# EAGLE design 2_dsub_to_pins_quick (EAGLE 7.2.0)
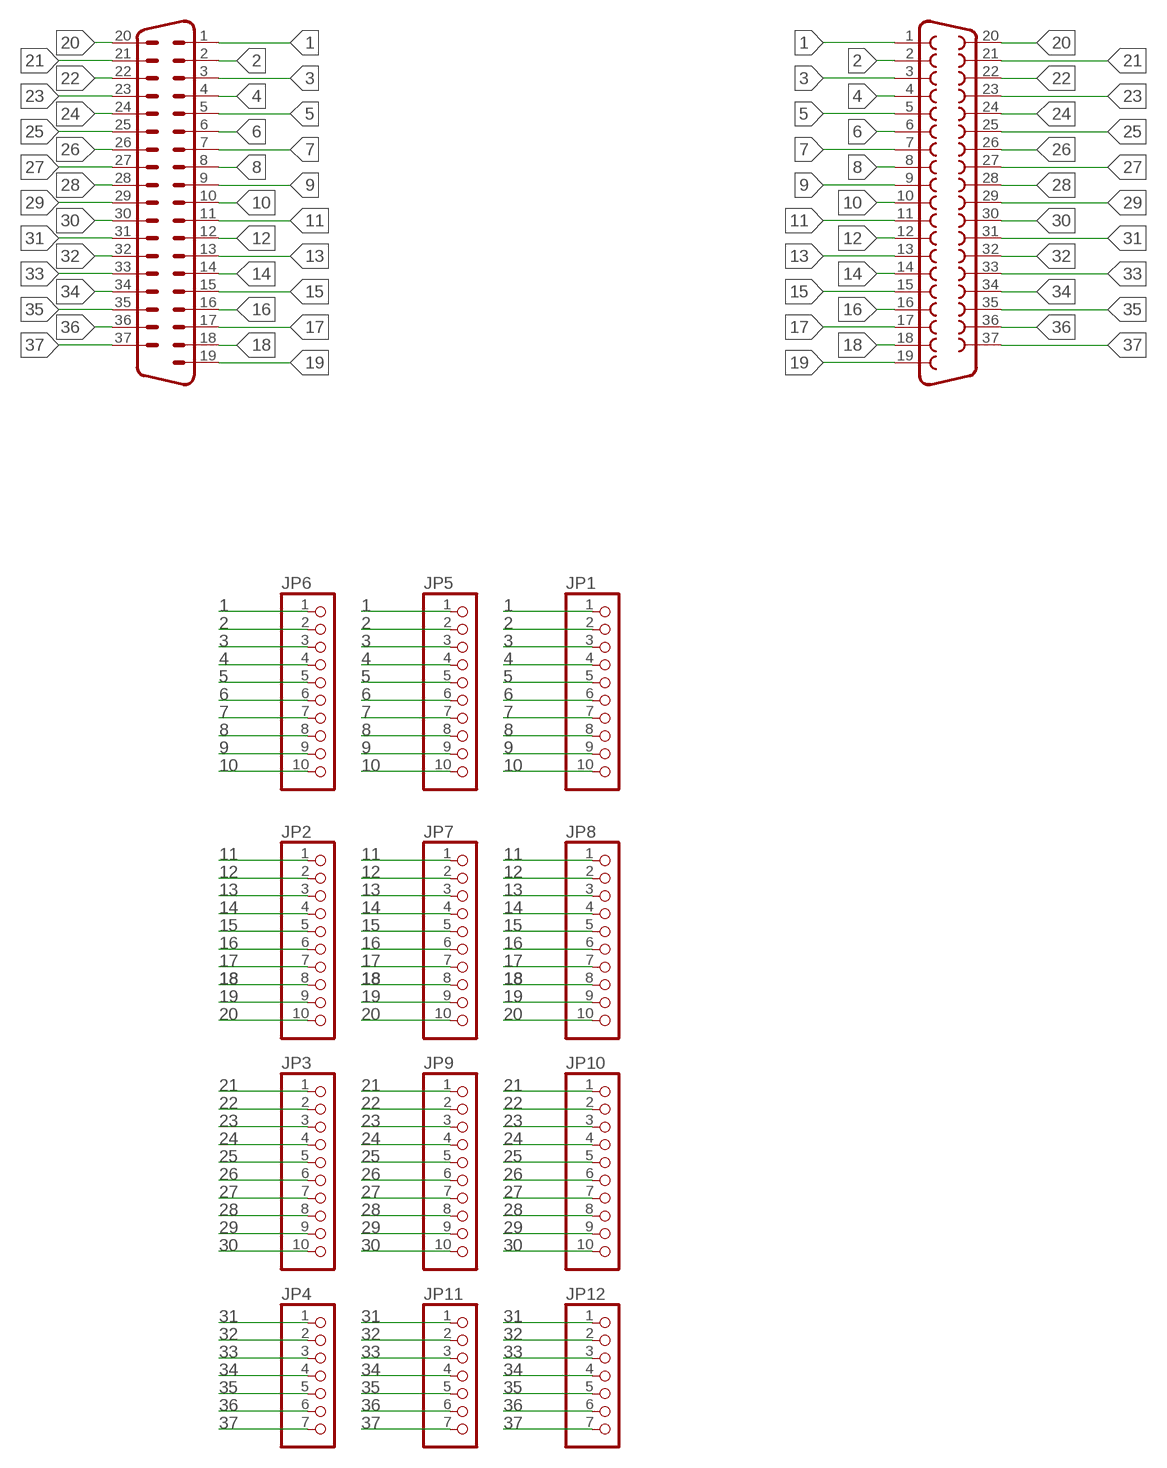
[diagram p0: schematic, sheet 1]

## Parts
JP1  PINHD-1X10  [1X10]
JP2  PINHD-1X10  [1X10]
JP3  PINHD-1X10  [1X10]
JP4  PINHD-1X7  [1X07]
JP5  PINHD-1X10  [1X10]
JP6  PINHD-1X10  [1X10]
JP7  PINHD-1X10  [1X10]
JP8  PINHD-1X10  [1X10]
JP9  PINHD-1X10  [1X10]
JP10  PINHD-1X10  [1X10]
JP11  PINHD-1X7  [1X07]
JP12  PINHD-1X7  [1X07]
X33  M37HP  [M37HP]
X34  F37HP  [F37HP]

## Nets
1: JP1.1 JP5.1 JP6.1 X33.1 X34.1
2: JP1.2 JP5.2 JP6.2 X33.2 X34.2
3: JP1.3 JP5.3 JP6.3 X33.3 X34.3
4: JP1.4 JP5.4 JP6.4 X33.4 X34.4
5: JP1.5 JP5.5 JP6.5 X33.5 X34.5
6: JP1.6 JP5.6 JP6.6 X33.6 X34.6
7: JP1.7 JP5.7 JP6.7 X33.7 X34.7
8: JP1.8 JP5.8 JP6.8 X33.8 X34.8
9: JP1.9 JP5.9 JP6.9 X33.9 X34.9
10: JP1.10 JP5.10 JP6.10 X33.10 X34.10
11: JP2.1 JP7.1 JP8.1 X33.11 X34.11
12: JP2.2 JP7.2 JP8.2 X33.12 X34.12
13: JP2.3 JP7.3 JP8.3 X33.13 X34.13
14: JP2.4 JP7.4 JP8.4 X33.14 X34.14
15: JP2.5 JP7.5 JP8.5 X33.15 X34.15
16: JP2.6 JP7.6 JP8.6 X33.16 X34.16
17: JP2.7 JP7.7 JP8.7 X33.17 X34.17
18: JP2.8 JP7.8 JP8.8 X33.18 X34.18
19: JP2.9 JP7.9 JP8.9 X33.19 X34.19
20: JP2.10 JP7.10 JP8.10 X33.20 X34.20
21: JP3.1 JP9.1 JP10.1 X33.21 X34.21
22: JP3.2 JP9.2 JP10.2 X33.22 X34.22
23: JP3.3 JP9.3 JP10.3 X33.23 X34.23
24: JP3.4 JP9.4 JP10.4 X33.24 X34.24
25: JP3.5 JP9.5 JP10.5 X33.25 X34.25
26: JP3.6 JP9.6 JP10.6 X33.26 X34.26
27: JP3.7 JP9.7 JP10.7 X33.27 X34.27
28: JP3.8 JP9.8 JP10.8 X33.28 X34.28
29: JP3.9 JP9.9 JP10.9 X33.29 X34.29
30: JP3.10 JP9.10 JP10.10 X33.30 X34.30
31: JP4.1 JP11.1 JP12.1 X33.31 X34.31
32: JP4.2 JP11.2 JP12.2 X33.32 X34.32
33: JP4.3 JP11.3 JP12.3 X33.33 X34.33
34: JP4.4 JP11.4 JP12.4 X33.34 X34.34
35: JP4.5 JP11.5 JP12.5 X33.35 X34.35
36: JP4.6 JP11.6 JP12.6 X33.36 X34.36
37: JP4.7 JP11.7 JP12.7 X33.37 X34.37

## Library data of the parts
JP1-JP3 JP5-JP10 = pinhead:PINHD-1X10: PIN HEADER
JP4 JP11 JP12 = pinhead:PINHD-1X7: PIN HEADER
X33 = con-subd:M37: SUB-D; OC_FARNELL: unknown; OC_NEWARK: unknown
X34 = con-subd:F37: SUB-D; OC_FARNELL: unknown; OC_NEWARK: unknown

## Board
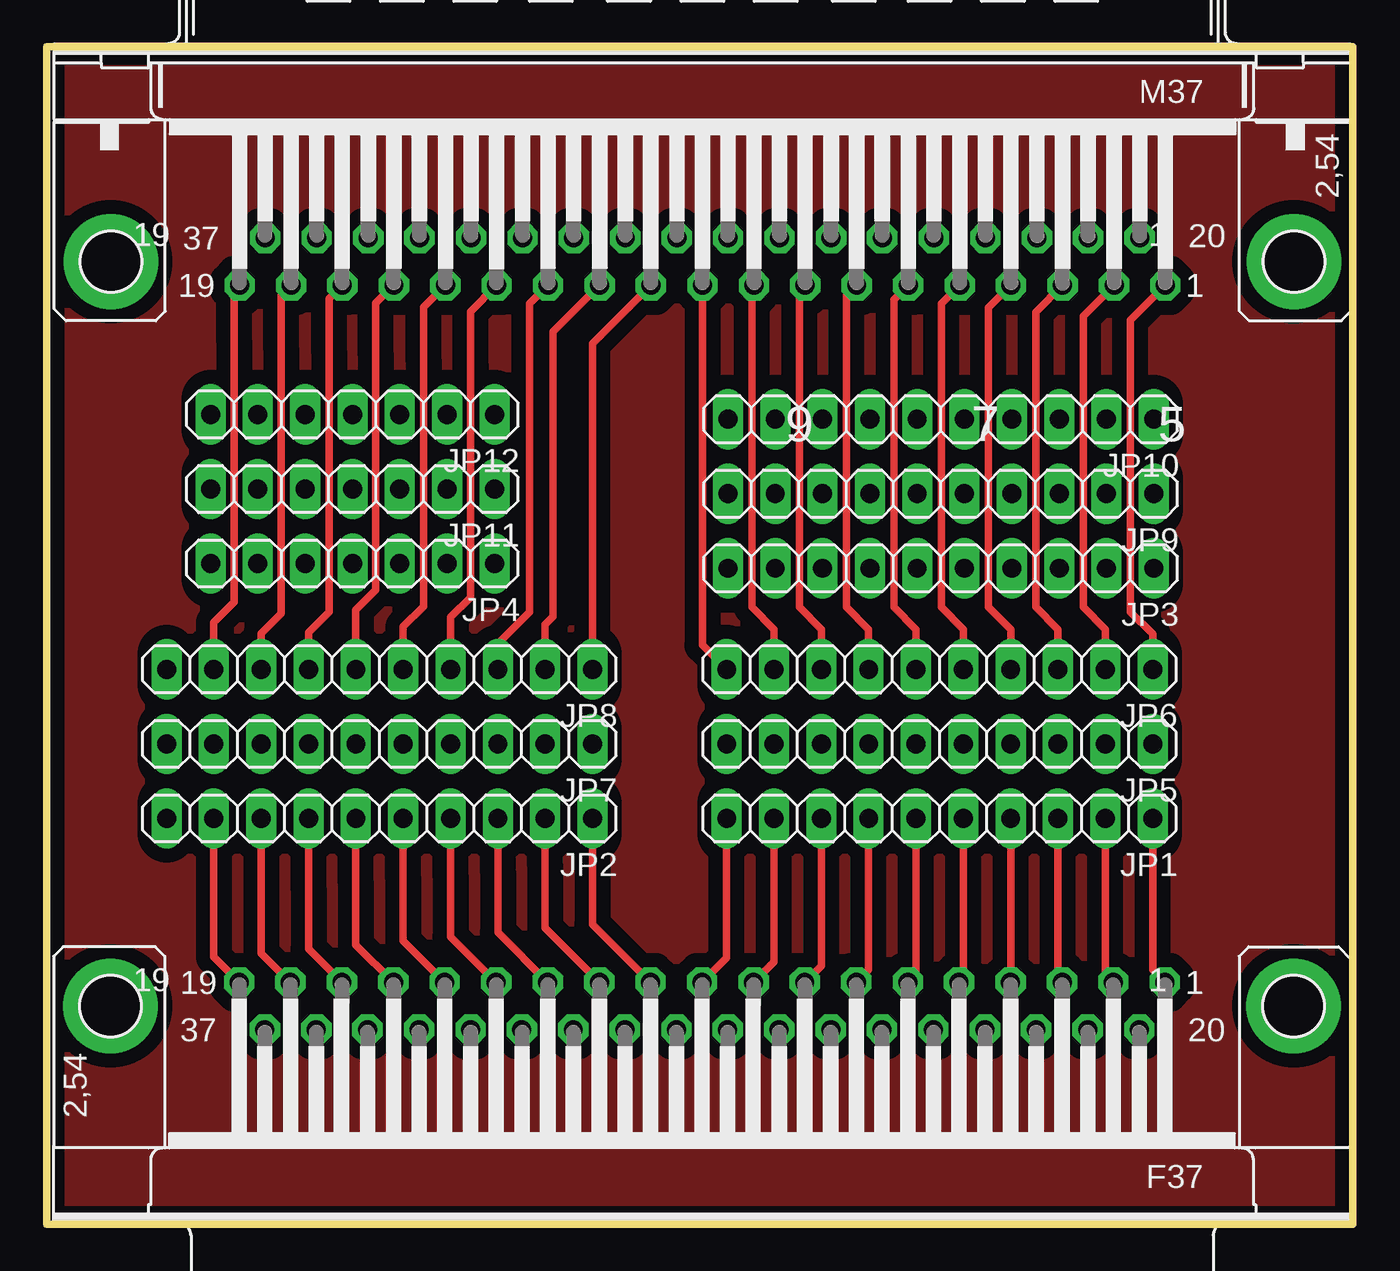
[diagram p1: board, top side]
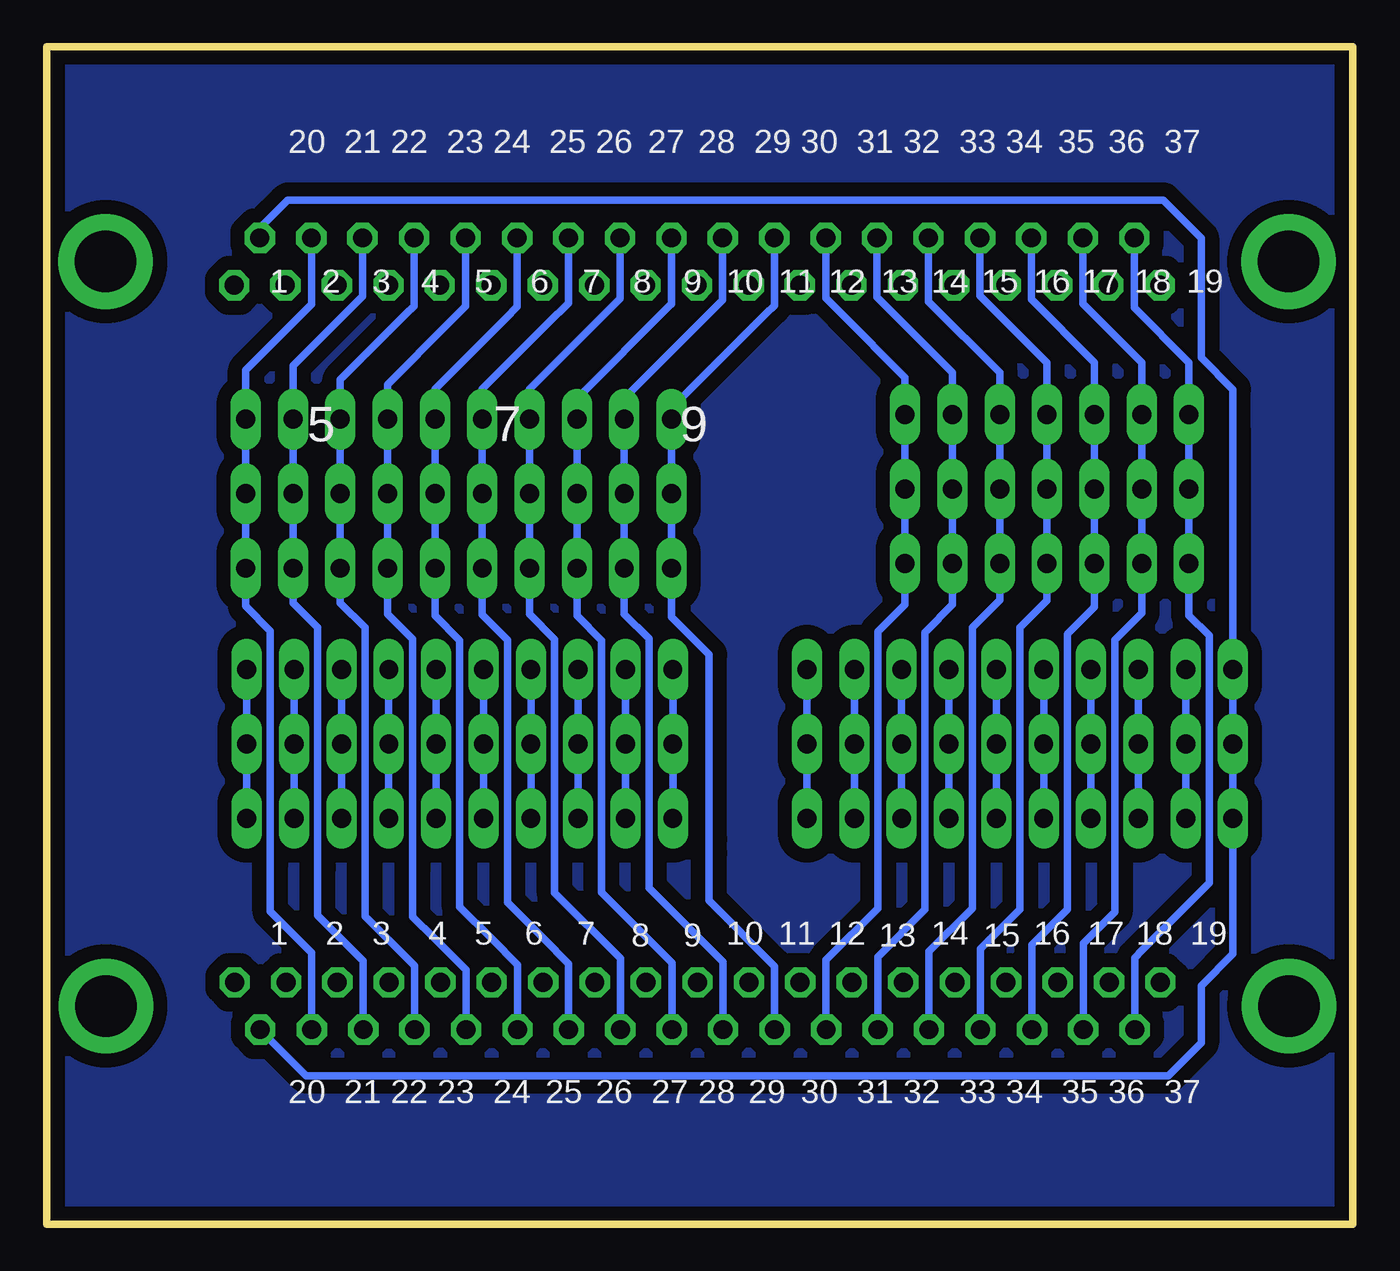
[diagram p2: board, bottom side, seen from below]

Size 70.11 x 63.21 mm. Coordinates in mm from the lower left corner, seen from the top.
Outline: 3,63.21 70.11,63.21 70.11,0 0,0 0,63.21 3.5,63.21
Copper layers (1*16): Top 0.035mm / dielectric 1.5mm / Bottom 0.035mm
Design rules "SparkFun-2-layer": minimum track width 7mil, minimum drill 15mil, track to track 8mil, track to pad 8mil, pad to pad 8mil, via to via 8mil, smd to smd 8mil, copper to edge 8mil, drill to drill 8mil, minimum pad ring 12mil, minimum via ring 10mil, stop-mask expansion 4mil, vias tented up to drill 20mil, thermal gap 10mil

### Footprints (pad centres in the part's own frame; a part is rotated, then mirrored left to right if it is on the bottom)
1X10 = drill 1.016 long: 1 -11.43,0; 2 -8.89,0; 3 -6.35,0; 4 -3.81,0; 5 -1.27,0; 6 1.27,0; 7 3.81,0; 8 6.35,0; 9 8.89,0; 10 11.43,0
1X07 = drill 1.016 long: 1 -7.62,0; 2 -5.08,0; 3 -2.54,0; 4 0,0; 5 2.54,0; 6 5.08,0; 7 7.62,0
M37HP = drill 1.016 octagon: 1 -24.841,1.27; 2 -22.098,1.27; 3 -19.329,1.27; 4 -16.561,1.27; 5 -13.818,1.27; 6 -11.049,1.27; 7 -8.28,1.27; 8 -5.512,1.27; 9 -2.769,1.27; 10 0,1.27; 11 2.769,1.27; 12 5.512,1.27; 13 8.28,1.27; 14 11.049,1.27; 15 13.792,1.27; 16 16.561,1.27; 17 19.329,1.27; 18 22.073,1.27; 19 24.841,1.27; 20 -23.47,-1.27; 21 -20.701,-1.27; 22 -17.958,-1.27; 23 -15.189,-1.27; 24 -12.421,-1.27; 25 -9.652,-1.27; 26 -6.909,-1.27; 27 -4.14,-1.27; 28 -1.372,-1.27; 29 1.372,-1.27; 30 4.14,-1.27; 31 6.909,-1.27; 32 9.652,-1.27; 33 12.421,-1.27; 34 15.189,-1.27; 35 17.932,-1.27; 36 20.701,-1.27; 37 23.47,-1.27 | drill 3.302 pad 5.08: G1 -31.75,0; G2 31.75,0
F37HP = drill 1.016 octagon: 1 -24.841,-1.27; 2 -22.073,-1.27; 3 -19.329,-1.27; 4 -16.561,-1.27; 5 -13.792,-1.27; 6 -11.049,-1.27; 7 -8.28,-1.27; 8 -5.512,-1.27; 9 -2.769,-1.27; 10 0,-1.27; 11 2.769,-1.27; 12 5.512,-1.27; 13 8.28,-1.27; 14 11.049,-1.27; 15 13.818,-1.27; 16 16.561,-1.27; 17 19.329,-1.27; 18 22.098,-1.27; 19 24.841,-1.27; 20 -23.47,1.27; 21 -20.701,1.27; 22 -17.932,1.27; 23 -15.189,1.27; 24 -12.421,1.27; 25 -9.652,1.27; 26 -6.909,1.27; 27 -4.14,1.27; 28 -1.372,1.27; 29 1.372,1.27; 30 4.14,1.27; 31 6.909,1.27; 32 9.677,1.27; 33 12.421,1.27; 34 15.189,1.27; 35 17.958,1.27; 36 20.701,1.27; 37 23.47,1.27 | drill 3.302 pad 5.08: G1 -31.75,0; G2 31.75,0

### Placement (x,y rotation side)
JP1  47.93,21.79 180 top
JP2  17.87,21.79 180 top
JP3  48,35.21 180 top
JP4  16.42,35.47 180 top
JP5  47.93,25.79 180 top
JP6  47.93,29.79 180 top
JP7  17.87,25.79 180 top
JP8  17.87,29.79 180 top
JP9  48,39.21 180 top
JP10  48,43.21 180 top
JP11  16.42,39.47 180 top
JP12  16.42,43.47 180 top
X33  35.2,51.67 180 top
X34  35.18,11.72 180 top

### Tracks (layer width: path | path; a pad name or v marks a point on that pad's centre or on a via)
1
  Top 0.4: JP6.1 59.36,31.68 58.18,32.87 58.18,48.54 X33.1 | X34.1 59.36,13.65 JP1.1
  Bottom 0.4: JP6.1 JP5.1 JP1.1
2
  Top 0.4: JP6.2 56.82,31.94 55.64,33.12 55.64,48.75 X33.2 | X34.2 56.82,13.42 JP1.2
  Bottom 0.4: JP6.2 JP5.2 JP1.2
3
  Top 0.4: JP6.3 54.28,31.94 53.1,33.12 53.1,48.97 X33.3 | X34.3 54.28,13.21 JP1.3
  Bottom 0.4: JP6.3 JP5.3 JP1.3
4
  Top 0.4: JP6.4 51.74,31.94 50.56,33.12 50.56,49.2 X33.4 | X34.4 JP1.4
  Bottom 0.4: JP6.4 JP5.4 JP1.4
5
  Top 0.4: JP6.5 49.2,31.94 48.02,33.12 48.02,49.41 X33.5 | X34.5 49.2,13.22 JP1.5
  Bottom 0.4: JP6.5 JP5.5 JP1.5
6
  Top 0.4: JP6.6 46.66,31.94 45.48,33.12 45.48,49.63 X33.6 | X34.6 46.66,13.43 JP1.6
  Bottom 0.4: JP6.6 JP5.6 JP1.6
7
  Top 0.4: JP6.7 44.12,31.94 42.94,33.12 42.94,49.86 X33.7 | X34.7 44.12,13.65 JP1.7
  Bottom 0.4: JP6.7 JP5.7 JP1.7
8
  Top 0.4: JP6.8 41.58,31.94 40.4,33.12 40.4,50.09 X33.8 | X34.8 41.58,13.88 JP1.8
  Bottom 0.4: JP6.8 JP5.8 JP1.8
9
  Top 0.4: JP6.9 39.04,31.94 37.86,33.12 37.86,50.29 X33.9 | X34.9 39.04,14.09 JP1.9
  Bottom 0.4: JP6.9 JP5.9 JP1.9
10
  Top 0.4: X33.10 35.2,31.09 JP6.10 | X34.10 36.5,14.31 JP1.10
  Bottom 0.4: JP6.10 JP5.10 JP1.10
11
  Top 0.4: JP8.1 29.3,44.48 29.3,47.27 X33.11 | JP2.1 29.3,19.4 29.3,16.1 X34.11
  Bottom 0.4: JP8.1 JP7.1 JP2.1
12
  Top 0.4: JP8.2 26.76,32.18 27.19,32.61 27.19,45.11 27.19,47.91 X33.12 | JP2.2 26.76,19.2 26.76,15.9 X34.12
  Bottom 0.4: JP8.2 JP7.2 JP2.2
13
  Top 0.4: JP8.3 24.22,31.17 25.92,32.87 25.92,46.33 25.92,49.41 X33.13 26.92,50.12 | JP2.3 24.22,18.97 24.22,15.67 X34.13
  Bottom 0.4: JP8.3 JP7.3 JP2.3
14
  Top 0.4: JP8.4 21.68,32.59 22.75,33.66 22.75,46.2 22.75,49 X33.14 | JP2.4 21.68,18.74 21.68,15.44 X34.14
  Bottom 0.4: JP8.4 JP7.4 JP2.4
15
  Top 0.4: JP8.5 19.14,32.08 20.23,33.17 20.23,46.43 20.23,49.23 X33.15 | JP2.5 19.14,18.51 19.14,15.21 X34.15
  Bottom 0.4: JP8.5 JP7.5 JP2.5
16
  Top 0.4: JP8.6 16.6,32.97 17.67,34.04 17.67,46.64 17.67,49.43 X33.16 | JP2.6 16.6,18.31 16.6,15.01 X34.16
  Bottom 0.4: JP8.6 JP7.6 JP2.6
17
  Top 0.4: JP8.7 14.06,31.78 15.15,32.87 15.15,46.89 15.15,49.69 X33.17 | JP2.7 14.06,18.08 14.06,14.78 X34.17
  Bottom 0.4: JP8.7 JP7.7 JP2.7
18
  Top 0.4: JP8.8 11.52,31.73 12.59,32.79 12.59,47.07 12.59,49.86 X33.18 | JP2.8 11.52,14.55 X34.18
  Bottom 0.4: JP8.8 JP7.8 JP2.8
19
  Top 0.4: JP8.9 8.98,32.31 10.07,33.4 10.07,47.32 10.07,50.12 X33.19 | JP2.9 8.98,14.35 X34.19
  Bottom 0.4: JP8.9 JP7.9 JP2.9
20
  Bottom 0.4: X34.20 56.18,7.98 9.92,7.98 8.14,9.75 8.14,12.8 6.44,14.5 JP2.10 6.44,22.45 JP7.10 JP8.10 6.44,42.6 6.44,44.81 8.14,46.51 8.14,49.89 8.14,52.93 10.17,54.97 57.16,54.97 58.67,53.46 X33.20
21
  Bottom 0.4: X33.21 55.89,49.38 59.43,45.84 JP10.1 JP9.1 JP3.1 59.43,34.39 | 59.43,34.39 59.43,33.61 | X34.21 55.88,13.55 | 55.88,13.55 55.89,13.56 | 55.88,13.55 55.88,14.57 58.1,16.79 58.1,19.33 58.1,31.85 59.43,33.18 59.43,34.39
22
  Bottom 0.4: X33.22 53.16,49.83 54.88,48.11 56.89,46.1 JP10.2 JP9.2 JP3.2 56.89,33.35 55.64,32.11 55.56,32.03 55.56,19.13 55.56,16.59 53.11,14.14 X34.22
23
  Bottom 0.4: X33.23 50.39,49.3 50.81,48.87 54.35,45.34 JP10.3 JP9.3 JP3.3 54.35,33.35 53.02,32.03 53.02,19.08 53.02,16.54 51.83,15.34 50.37,13.88 X34.23
24
  Bottom 0.4: X33.24 47.62,49.27 48.53,48.36 51.81,45.08 JP10.4 JP9.4 JP3.4 51.81,32.77 50.46,31.42 50.46,19.05 50.46,16.51 49.29,15.34 47.6,13.65 X34.24
25
  Bottom 0.4: X33.25 44.85,49.24 45.48,48.62 49.27,44.83 JP10.5 JP9.5 JP3.5 49.27,32.67 47.94,31.34 47.94,19.91 | X34.25 44.83,13.93 46.24,15.34 47.94,17.04 47.94,19.91 | 47.94,19.58 47.94,19.91
26
  Bottom 0.4: X33.26 42.11,49.45 43.19,48.36 46.73,44.83 JP10.6 JP9.6 JP3.6 46.73,32.72 45.38,31.37 45.38,20.42 | X34.26 42.09,13.98 43.45,15.34 45.38,17.27 45.38,20.42 | 45.38,19.81 45.38,20.42
27
  Bottom 0.4: X33.27 39.34,49.68 39.89,49.12 44.19,44.83 JP10.7 JP9.7 JP3.7 44.19,32.74 42.84,31.39 42.84,21.18 | X34.27 39.32,14.26 42.84,17.78 42.84,21.18 | 42.84,20.32 42.84,21.18
28
  Bottom 0.4: X33.28 36.57,49.4 36.59,49.38 41.65,44.32 JP10.8 JP9.8 JP3.8 41.65,32.67 40.32,31.34 40.32,20.93 | X34.28 36.55,14.03 40.32,17.81 40.32,20.93 | 40.32,20.35 40.32,20.93
29
  Bottom 0.4: X33.29 33.83,49.6 34.05,49.38 39.11,44.32 JP10.9 JP9.9 JP3.9 39.11,32.77 37.78,31.45 37.78,20.6 37.78,20.09 37.78,18.06 34.3,14.58 33.81,14.08 X34.29
30
  Bottom 0.4: X33.30 31.06,49.32 31.51,48.87 36.57,43.81 JP10.10 JP9.10 JP3.10 36.57,32.59 34.94,30.96 | 34.94,30.96 34.56,30.58 | X34.30 31.04,13.86 34.56,17.37 34.56,20.68 | 34.56,19.91 34.56,20.68 | 34.56,20.68 34.56,30.58 | 34.56,30.58 34.94,30.96
31
  Bottom 0.4: X33.31 28.29,49.72 27.45,48.87 | 27.45,48.87 27.19,48.62 | X34.31 28.27,12.04 28.27,14.19 25.49,16.97 25.49,20.27 25.49,31.83 24.04,33.28 JP4.1 JP11.1 JP12.1 24.04,45.46 27.45,48.87
32
  Bottom 0.4: X33.32 25.55,49.77 21.5,45.71 JP12.2 JP11.2 JP4.2 21.5,33.26 22.95,31.8 22.98,31.78 22.98,20.19 22.98,16.89 25.5,14.36 25.5,13.06 X34.32
33
  Bottom 0.4: X33.33 22.78,49.54 18.96,45.71 JP12.3 JP11.3 JP4.3 18.96,33.51 20.44,32.03 20.44,20.27 20.44,16.97 22.76,14.64 X34.33
34
  Bottom 0.4: X33.34 20.01,49.86 16.42,46.26 JP12.4 JP11.4 JP4.4 16.42,33.48 17.79,32.11 17.87,32.03 17.87,20.19 17.87,16.89 19.99,14.77 19.99,13.56 X34.34
35
  Bottom 0.4: X33.35 17.27,49.65 13.88,46.26 JP12.5 JP11.5 JP4.5 13.88,33.13 15.3,31.7 15.3,31.67 15.33,31.65 15.33,20.19 15.33,16.89 17.22,15 17.22,14.58 X34.35
36
  Bottom 0.4: X33.36 14.5,49.42 11.34,46.26 JP12.6 JP11.6 JP4.6 11.34,32.82 12.79,31.37 12.79,20.07 12.79,16.76 14.48,15.08 X34.36
37
  Bottom 0.4: X33.37 11.73,49.2 8.8,46.26 JP12.7 JP11.7 JP4.7 8.8,32.68 7.71,31.6 7.71,20.68 7.71,20.35 7.71,18.31 11.32,14.71 | X34.37 11.71,14.31 11.32,14.71 | 11.32,14.71 10.68,15.34
S$1
  pour Top (isolate 0.762): 0.01,63.09 70.12,63.09 70.12,0.1 0.01,0.1
S$2
  pour Bottom (isolate 0.762): 0.01,63.35 70.12,63.35 70.12,0.1 0.01,0.1

### Text on the board
tNames: 19 | 1 | 9 | 7 | 5 | 19 | 1
bNames: 37 | 36 | 35 | 34 | 33 | 32 | 31 | 30 | 29 | 28 | 27 | 26 | 25 | 24 | 23 | 22 | 21 | 20 | 19 | 18 | 17 | 16 | 15 | 14 | 13 | 12 | 11 | 10 | 9 | 8 | 7 | 6 | 5 | 4 | 3 | 2 | 1 | 9 | 7 | 5 | 19 | 18 | 17 | 16 | 15 | 14 | 13 | 12 | 11 | 10 | 9 | 8 | 7 | 6 | 5 | 4 | 3 | 2 | 1 | 37 | 36 | 35 | 34 | 33 | 32 | 31 | 30 | 29 | 28 | 27 | 26 | 25 | 24 | 23 | 22 | 21 | 20
tDocu: 37 | 36 | 35 | 34 | 33 | 32 | 31 | 30 | 29 | 28 | 27 | 26 | 25 | 24 | 23 | 22 | 21 | 20 | 19 | 18 | 17 | 16 | 15 | 14 | 13 | 12 | 11 | 10 | 9 | 8 | 7 | 6 | 5 | 4 | 3 | 2 | 1 | 31 | 32 | 33 | 34 | 35 | 36 | 37 | 30 | 29 | 28 | 27 | 26 | 25 | 24 | 23 | 22 | 21 | DSUB TO PINS | 20 | 19 | 18 | 17 | 16 | 15 | 14 | 13 | 12 | 11 | 10 | 9 | 8 | 7 | 6 | 5 | 4 | 3 | 2 | 1 | 19 | 18 | 17 | 16 | 15 | 14 | 13 | 12 | 11 | 10 | 9 | 8 | 7 | 6 | 5 | 4 | 3 | 2 | 1 | 37 | 36 | 35 | 34 | 33 | 31 | 30 | 29 | 28 | 27 | 26 | 25 | 24 | 23 | 22 | 21 | 20 | 32
bDocu: 37 | 36 | 35 | 34 | 33 | 32 | 31 | 30 | 29 | 28 | 27 | 26 | 25 | 24 | 23 | 22 | 21 | 20 | 9 | 8 | 6 | 5 | 4 | 3 | 2 | 1 | 19 | 18 | 17 | 16 | 15 | 14 | 13 | 12 | 11 | 10 | 7 | 37 | 36 | 35 | 34 | 33 | 32 | 31 | 30 | 29 | 28 | 27 | 26 | 25 | 24 | 23 | 22 | 21 | DSUB TO PINS | 20 | 19 | 18 | 17 | 16 | 15 | 14 | 13 | 12 | 11 | 10 | 9 | 8 | 7 | 6 | 5 | 4 | 3 | 2 | 1 | 19 | 18 | 17 | 16 | 15 | 14 | 13 | 12 | 11 | 10 | 9 | 8 | 7 | 6 | 5 | 4 | 3 | 2 | 1 | 37 | 36 | 35 | 34 | 33 | 32 | 31 | 30 | 29 | 28 | 27 | 26 | 25 | 24 | 23 | 22 | 21 | 20